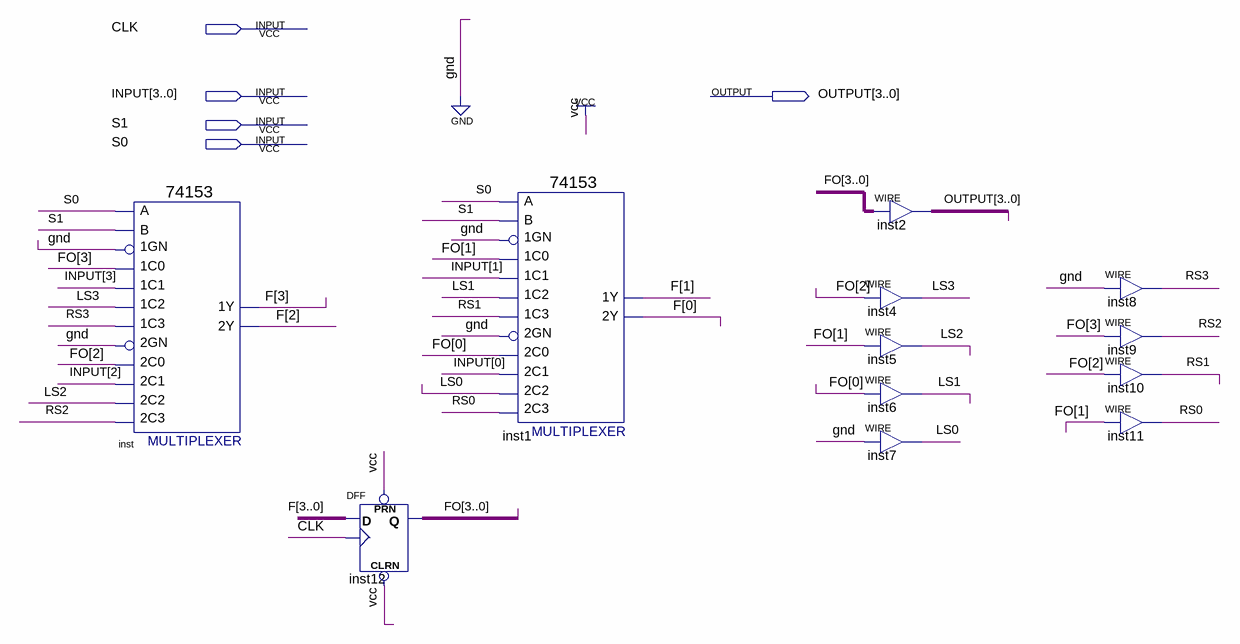
[diagram p0: schematic sheet]
// Quartus schematic lab4quiz.bdf as structural Verilog: 12 symbols, 5 pins
module lab4quiz (
  input  CLK,
  input  [3:0] INPUT,
  input  S1,
  input  S0,
  output [3:0] OUTPUT
);

  wire LS0, LS1, LS2, LS3, RS0, RS1, RS2, RS3;
  wire [3:0] F, FO;

  \74153  inst (
    .\1C1 (INPUT[3]), .\1GN (1'b0), .\1C0 (FO[3]), .\2C0 (FO[2]), .\2GN (1'b0), .\2C2 (LS2), .\1C2 (LS3),
    .\1C3 (RS3), .B(S1), .A(S0), .\2C1 (INPUT[2]), .\2C3 (RS2), .\1Y (F[3]), .\2Y (F[2]));
  DFF inst12[3:0] (.CLRN(1'b1), .CLK(CLK), .D(F), .PRN(1'b1), .Q(FO));
  \74153  inst1 (
    .\1C1 (INPUT[1]), .\1GN (1'b0), .\1C0 (FO[1]), .\2C0 (FO[0]), .\2GN (1'b0), .\2C2 (LS0), .\1C2 (LS1),
    .\1C3 (RS1), .B(S1), .A(S0), .\2C1 (INPUT[0]), .\2C3 (RS0), .\1Y (F[1]), .\2Y (F[0]));
  assign OUTPUT = FO;  // WIRE inst2
  assign LS3 = FO[2];  // WIRE inst4
  assign LS2 = FO[1];  // WIRE inst5
  assign LS1 = FO[0];  // WIRE inst6
  assign LS0 = 1'b0;  // WIRE inst7
  assign RS3 = 1'b0;  // WIRE inst8
  assign RS2 = FO[3];  // WIRE inst9
  assign RS1 = FO[2];  // WIRE inst10
  assign RS0 = FO[1];  // WIRE inst11
endmodule
